# Altium schematic sheet SENSOR.SchDoc
size A4
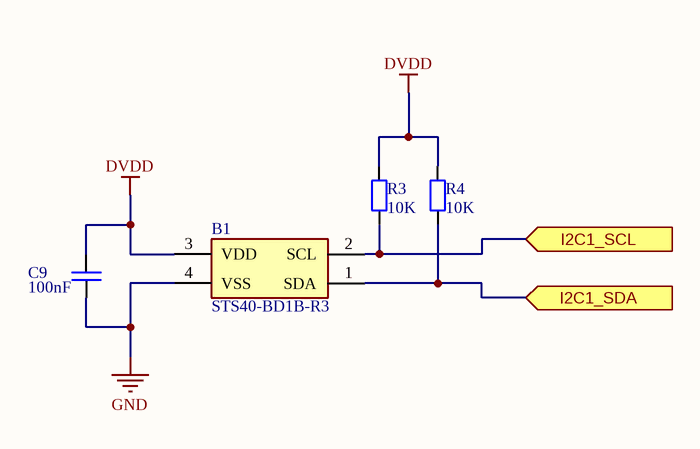
[diagram p0: SENSOR.SchDoc]

## Parts
B1  STS40-BD1B-R3  [STS40BD1BR3]
C9  100nF  [CAP_SM0805_YAGEOCC2_N]
R3  10K  [RES_SM0805_YAGEORC_N]
R4  10K  [RES_SM0805_YAGEORC_N]

## Ports
I2C1_SCL (in), I2C1_SDA (in)

## Nets
DVDD: B1.3(VDD) C9.2 R3.2 R4.2
GND: B1.4(VSS) C9.1
I2C1_SCL: B1.2(SCL) R3.1 ; port I2C1_SCL
I2C1_SDA: B1.1(SDA) R4.1 ; port I2C1_SDA

## Notes on the sheet
- Title:
- Size: A4
- Date:
- FMC-320U MODEL A
- Sheet:
- Time:
- Of:
- Version:
- Revision:
- Release:
- 1
- 0
- FLOWMEET SRL
- File

## Library data of the parts
B1 = STS40-BD1B-R3: Board Mount Temperature Sensors Base Accuracy Version, I2C Address 0x45; Manufacturer_Name: Sensirion; Geometry.Height: 0.65mm; Arrow Part Number: STS40-BD1B-R3; Arrow Price/Stock: https://www.arrow.com/en/products/sts40-bd1b-r3/sensirion-ag?region=nac; Datasheet Link: https://sensirion.com/media/documents/D2D0B4A9/62CBE395/Sensirion_Datasheet_STS4x.pdf; Manufacturer_Part_Number: STS40-BD1B-R3
C9 = CC0805KRX7R8BB104: CAP 100nF SM0805 X7R 25V YAGEO CC2; Tolerance (%): 10; Voltage Rating (Volts): 25; Category: Capacitor; Manufacturer: Yageo; Manufacturer Part Number: CC0805KRX7R8BB104; Package: 0805; Value: 100nF; Supplier Part Number 1: 644249; Supplier 1: Farnell; ComponentLink1URL: http://www.yageo.com; ComponentLink1Description: Manufacturer Website; Supplier 2: Digi-Key; Supplier Part Number 2: 311-1141-1-ND; Datasheet: https://datasheet.lcsc.com/lcsc/2006111832_YAGEO-CC0805KRX7R8BB104_C519981.pdf
R3 R4 = RC0805FR-0710KL: RES 10K SM0805 YAGEO RC_L; Power (Watts): 0.125; Resistance (Ohms): 10000; Tolerance (%): 1; Category: Resistor; Manufacturer: Yageo; Manufacturer Part Number: RC0805FR-0710KL; Package: 0805; Value: 10K; Supplier Part Number 1: 9237755; Supplier 1: Farnell; ComponentLink1Description: Manufacturer Website; ComponentLink1URL: http://www.yageo.com; Supplier 2: Digi-Key; Supplier Part Number 2: 311-10.0KCRCT-ND; Datasheet: https://www.yageo.com/upload/media/product/app/datasheet/rchip/pyu-rc_group_51_rohs_l.pdf